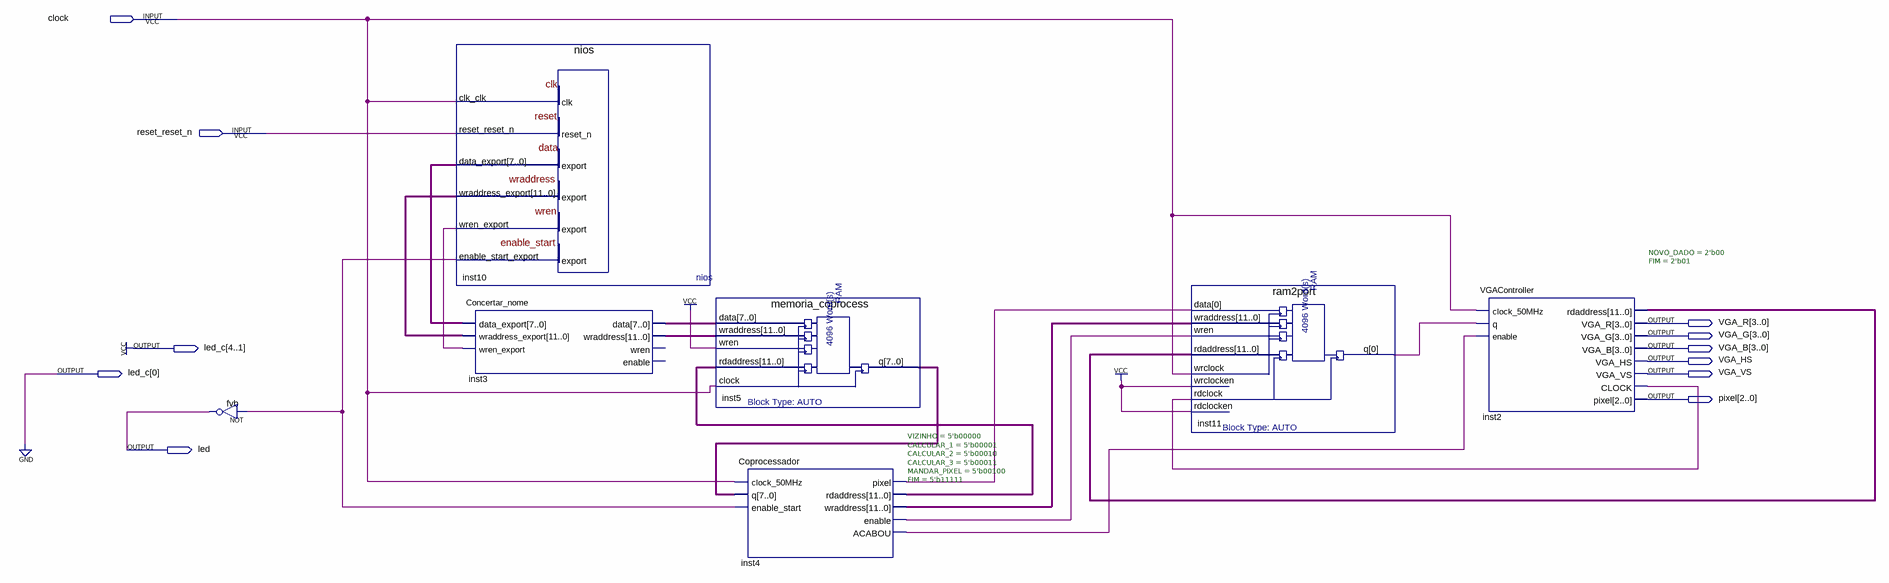
[diagram p0: schematic sheet]
// Quartus schematic PBL3_Final.bdf as structural Verilog: 7 symbols, 11 pins
module PBL3_Final (
  input  clock,
  input  reset_reset_n,
  output [3:0] VGA_R,
  output [3:0] VGA_G,
  output [4:0] led_c,
  output [3:0] VGA_B,
  output VGA_HS,
  output VGA_VS,
  output [2:0] pixel,
  output led
);

  wire inst2_clock, inst4_acabou, inst4_enable, inst4_pixel, inst10_enable_start_export, inst10_wren_export,
       inst11_q;
  wire [7:0] inst3_data, inst5_q, inst10_data_export;
  wire [11:0] inst2_rdaddress, inst3_wraddress, inst4_rdaddress, inst4_wraddress, inst10_wraddress_export;

  not fvb (led, inst10_enable_start_export);
  nios inst10 (
    .clk_clk(clock), .reset_reset_n(reset_reset_n), .data_export(inst10_data_export),
    .wraddress_export(inst10_wraddress_export), .wren_export(inst10_wren_export),
    .enable_start_export(inst10_enable_start_export));
  Concertar_nome inst3 (
    .data_export(inst10_data_export), .wraddress_export(inst10_wraddress_export),
    .wren_export(inst10_wren_export), .data(inst3_data), .wraddress(inst3_wraddress));  // open: wren, enable
  memoria_coprocess inst5 (
    .data(inst3_data), .wraddress(inst3_wraddress), .wren(1'b1), .rdaddress(inst4_rdaddress), .clock(clock),
    .q(inst5_q));
  Coprocessador #(.VIZINHO(5'b00000), .CALCULAR_1(5'b00001), .CALCULAR_2(5'b00010), .CALCULAR_3(5'b00011), .MANDAR_PIXEL(5'b00100), .FIM(5'b11111)) inst4 (
    .clock_50MHz(clock), .q(inst5_q), .enable_start(inst10_enable_start_export), .pixel(inst4_pixel),
    .rdaddress(inst4_rdaddress), .wraddress(inst4_wraddress), .enable(inst4_enable), .ACABOU(inst4_acabou));
  ram2port inst11 (
    .data(inst4_pixel), .wraddress(inst4_wraddress), .wren(inst4_enable), .rdaddress(inst2_rdaddress),
    .wrclock(clock), .wrclocken(1'b1), .rdclock(inst2_clock), .rdclocken(1'b1), .q(inst11_q));
  VGAController #(.NOVO_DADO(2'b00), .FIM(2'b01)) inst2 (
    .clock_50MHz(clock), .q(inst11_q), .enable(inst4_acabou), .rdaddress(inst2_rdaddress), .VGA_R(VGA_R),
    .VGA_G(VGA_G), .VGA_B(VGA_B), .VGA_HS(VGA_HS), .VGA_VS(VGA_VS), .CLOCK(inst2_clock), .pixel(pixel));

  assign led_c = 5'b11110;
endmodule
